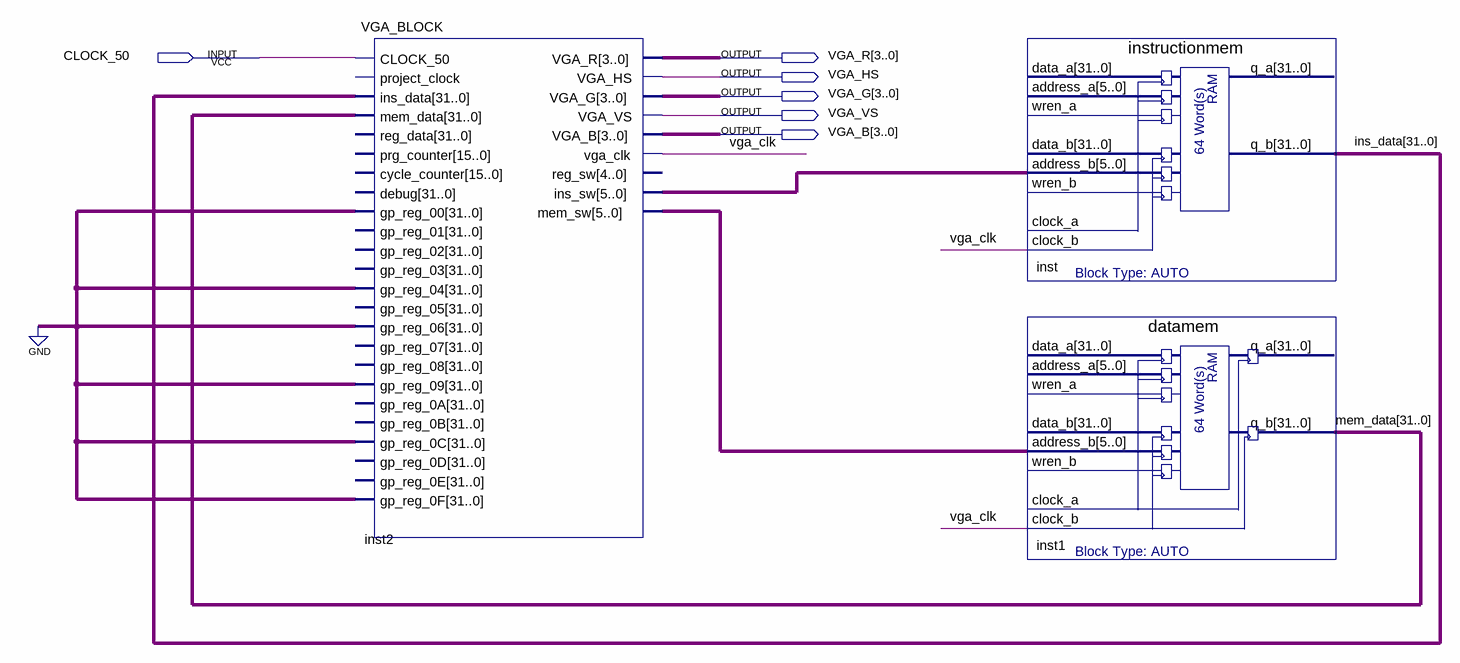
[diagram p0: schematic sheet]
// Quartus schematic VGADEMO.bdf as structural Verilog: 3 symbols, 6 pins
module VGADEMO (
  input  CLOCK_50,
  output [3:0] VGA_R,
  output VGA_HS,
  output [3:0] VGA_G,
  output VGA_VS,
  output [3:0] VGA_B
);

  wire vga_clk;
  wire [5:0] inst2_ins_sw, inst2_mem_sw;
  wire [31:0] ins_data, mem_data;

  VGA_BLOCK inst2 (
    .CLOCK_50(CLOCK_50), .ins_data(ins_data), .mem_data(mem_data), .gp_reg_00({32{1'b0}}),
    .gp_reg_04({32{1'b0}}), .gp_reg_06({32{1'b0}}), .gp_reg_09({32{1'b0}}), .gp_reg_0C({32{1'b0}}),
    .gp_reg_0F({32{1'b0}}), .VGA_R(VGA_R), .VGA_HS(VGA_HS), .VGA_G(VGA_G), .VGA_VS(VGA_VS), .VGA_B(VGA_B),
    .vga_clk(vga_clk), .ins_sw(inst2_ins_sw), .mem_sw(inst2_mem_sw));  // open: project_clock, reg_data, prg_counter, cycle_counter, debug, gp_reg_01, gp_reg_02, gp_reg_03, gp_reg_05, gp_reg_07, gp_reg_08, gp_reg_0A, gp_reg_0B, gp_reg_0D, gp_reg_0E, reg_sw
  instructionmem inst (
    .address_b(inst2_ins_sw), .clock_b(vga_clk), .q_b(ins_data));  // open: data_a, address_a, wren_a, data_b, wren_b, clock_a, q_a
  datamem inst1 (
    .address_b(inst2_mem_sw), .clock_b(vga_clk), .q_b(mem_data));  // open: data_a, address_a, wren_a, data_b, wren_b, clock_a, q_a
endmodule
